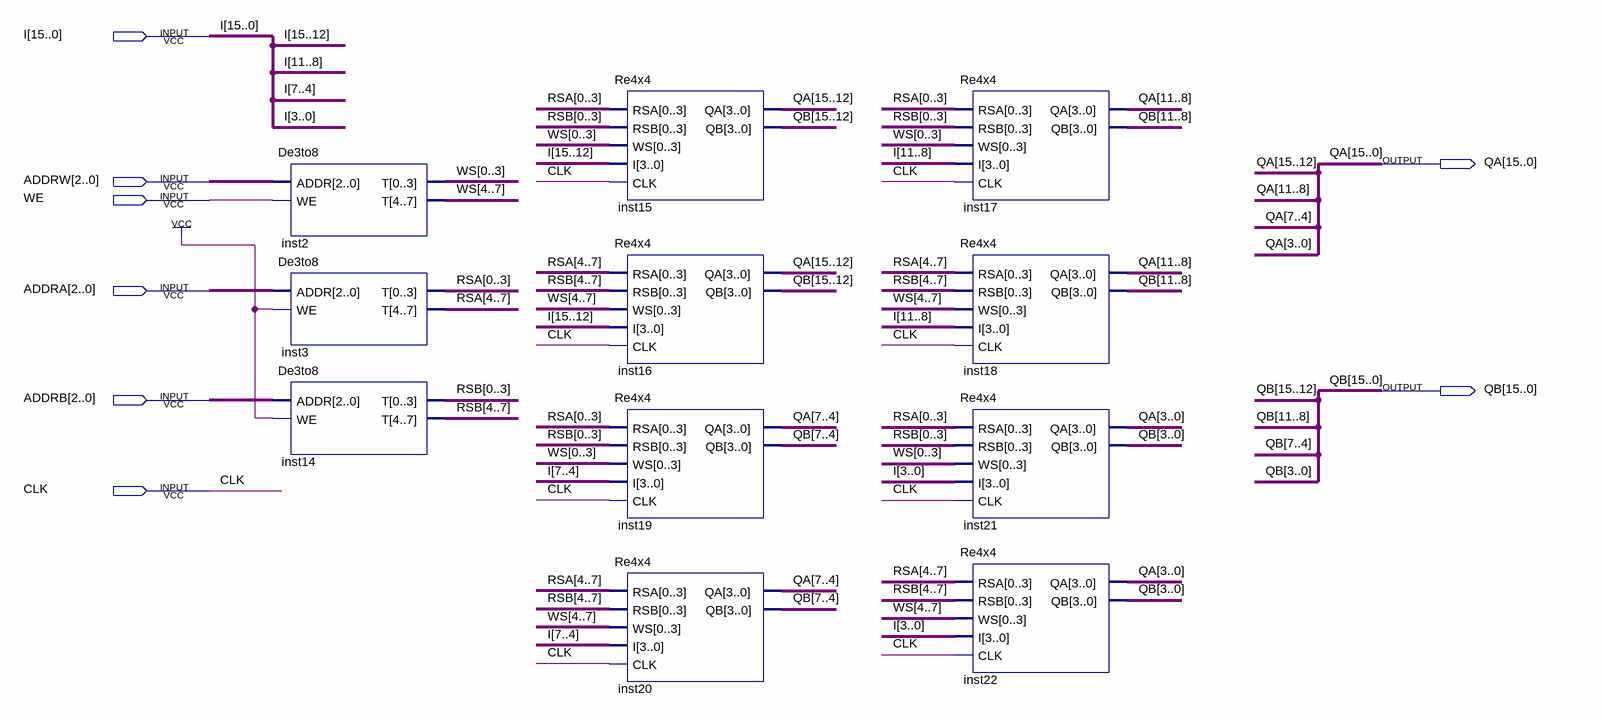
[diagram p0: schematic sheet]
// Quartus schematic Register_File.bdf as structural Verilog: 11 symbols, 8 pins
module Register_File (
  input  [15:0] I,
  input  [2:0] ADDRW,
  input  WE,
  input  [2:0] ADDRA,
  input  [2:0] ADDRB,
  input  CLK,
  output [15:0] QA,
  output [15:0] QB
);

  wire [7:0] RSA, RSB, WS;

  De3to8 inst2 (.ADDR(ADDRW), .WE(WE), .T(WS));
  De3to8 inst3 (.ADDR(ADDRA), .WE(1'b1), .T(RSA));
  De3to8 inst14 (.ADDR(ADDRB), .WE(1'b1), .T(RSB));
  Re4x4 inst15 (
    .RSA({RSA[0], RSA[1], RSA[2], RSA[3]}), .RSB({RSB[0], RSB[1], RSB[2], RSB[3]}),
    .WS({WS[0], WS[1], WS[2], WS[3]}), .I(I[15:12]), .CLK(CLK), .QA(QA[15:12]), .QB(QB[15:12]));
  Re4x4 inst16 (
    .RSA({RSA[4], RSA[5], RSA[6], RSA[7]}), .RSB({RSB[4], RSB[5], RSB[6], RSB[7]}),
    .WS({WS[4], WS[5], WS[6], WS[7]}), .I(I[15:12]), .CLK(CLK), .QA(QA[15:12]), .QB(QB[15:12]));
  Re4x4 inst19 (
    .RSA({RSA[0], RSA[1], RSA[2], RSA[3]}), .RSB({RSB[0], RSB[1], RSB[2], RSB[3]}),
    .WS({WS[0], WS[1], WS[2], WS[3]}), .I(I[7:4]), .CLK(CLK), .QA(QA[7:4]), .QB(QB[7:4]));
  Re4x4 inst20 (
    .RSA({RSA[4], RSA[5], RSA[6], RSA[7]}), .RSB({RSB[4], RSB[5], RSB[6], RSB[7]}),
    .WS({WS[4], WS[5], WS[6], WS[7]}), .I(I[7:4]), .CLK(CLK), .QA(QA[7:4]), .QB(QB[7:4]));
  Re4x4 inst17 (
    .RSA({RSA[0], RSA[1], RSA[2], RSA[3]}), .RSB({RSB[0], RSB[1], RSB[2], RSB[3]}),
    .WS({WS[0], WS[1], WS[2], WS[3]}), .I(I[11:8]), .CLK(CLK), .QA(QA[11:8]), .QB(QB[11:8]));
  Re4x4 inst18 (
    .RSA({RSA[4], RSA[5], RSA[6], RSA[7]}), .RSB({RSB[4], RSB[5], RSB[6], RSB[7]}),
    .WS({WS[4], WS[5], WS[6], WS[7]}), .I(I[11:8]), .CLK(CLK), .QA(QA[11:8]), .QB(QB[11:8]));
  Re4x4 inst21 (
    .RSA({RSA[0], RSA[1], RSA[2], RSA[3]}), .RSB({RSB[0], RSB[1], RSB[2], RSB[3]}),
    .WS({WS[0], WS[1], WS[2], WS[3]}), .I(I[3:0]), .CLK(CLK), .QA(QA[3:0]), .QB(QB[3:0]));
  Re4x4 inst22 (
    .RSA({RSA[4], RSA[5], RSA[6], RSA[7]}), .RSB({RSB[4], RSB[5], RSB[6], RSB[7]}),
    .WS({WS[4], WS[5], WS[6], WS[7]}), .I(I[3:0]), .CLK(CLK), .QA(QA[3:0]), .QB(QB[3:0]));
endmodule
